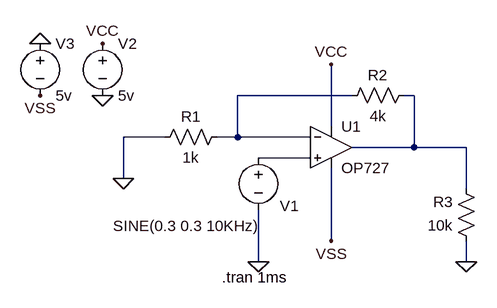
[diagram p0: schematic 6432067021-PB3.asc]
6432067021-PB3.asc, the LTspice schematic file:
Version 4
SHEET 1 880 680
WIRE 80 32 -96 32
WIRE 176 32 160 32
WIRE 48 80 48 -16
WIRE -208 96 -272 96
WIRE -96 96 -96 32
WIRE -96 96 -128 96
WIRE 16 96 -96 96
WIRE 176 112 176 32
WIRE 176 112 80 112
WIRE 256 112 176 112
WIRE 16 128 -64 128
WIRE -272 160 -272 96
WIRE 256 176 256 112
WIRE 48 256 48 144
WIRE -64 288 -64 208
WIRE 256 288 256 256
FLAG -64 288 0
FLAG 48 -16 VCC
FLAG -304 -48 VCC
FLAG -304 32 0
FLAG 48 256 VSS
FLAG -400 -48 0
FLAG -400 32 VSS
FLAG -272 160 0
FLAG 256 288 0
SYMBOL voltage -64 112 R0
WINDOW 123 0 0 Left 0
WINDOW 39 0 0 Left 0
WINDOW 0 33 90 Left 2
WINDOW 3 -224 121 Left 2
SYMATTR InstName V1
SYMATTR Value SINE(0.3 0.3 10KHz)
SYMBOL voltage -304 -64 R0
WINDOW 123 0 0 Left 0
WINDOW 39 0 0 Left 0
SYMATTR InstName V2
SYMATTR Value 5v
SYMBOL OP727 48 48 R0
SYMATTR InstName U1
SYMBOL voltage -400 -64 R0
WINDOW 123 0 0 Left 0
WINDOW 39 0 0 Left 0
SYMATTR InstName V3
SYMATTR Value 5v
SYMBOL Res -112 80 R90
WINDOW 0 0 56 VBottom 2
WINDOW 3 32 56 VTop 2
SYMATTR InstName R1
SYMATTR Value 1k
SYMBOL Res 176 16 R90
WINDOW 0 0 56 VBottom 2
WINDOW 3 32 56 VTop 2
SYMATTR InstName R2
SYMATTR Value 4k
SYMBOL Res 272 272 R180
WINDOW 0 36 76 Left 2
WINDOW 3 36 40 Left 2
SYMATTR InstName R3
SYMATTR Value 10k
TEXT -120 312 Left 2 !.tran 1ms

The netlist it stands for:
* 6432067021-PB3.asc
V1 N003 0 SINE(0.3 0.3 10KHz)
V2 VCC 0 5v
* U1: OP727 (symbol OP727 not available, pins judged from their places): In+=N003 In-=N001 V+=VCC V-=VSS OUT=N002
V3 0 VSS 5v
R1 N001 0 1k
R2 N002 N001 4k
R3 0 N002 10k
.tran 1ms
.backanno
.end